# Altium project buck_converter.PrjPcb
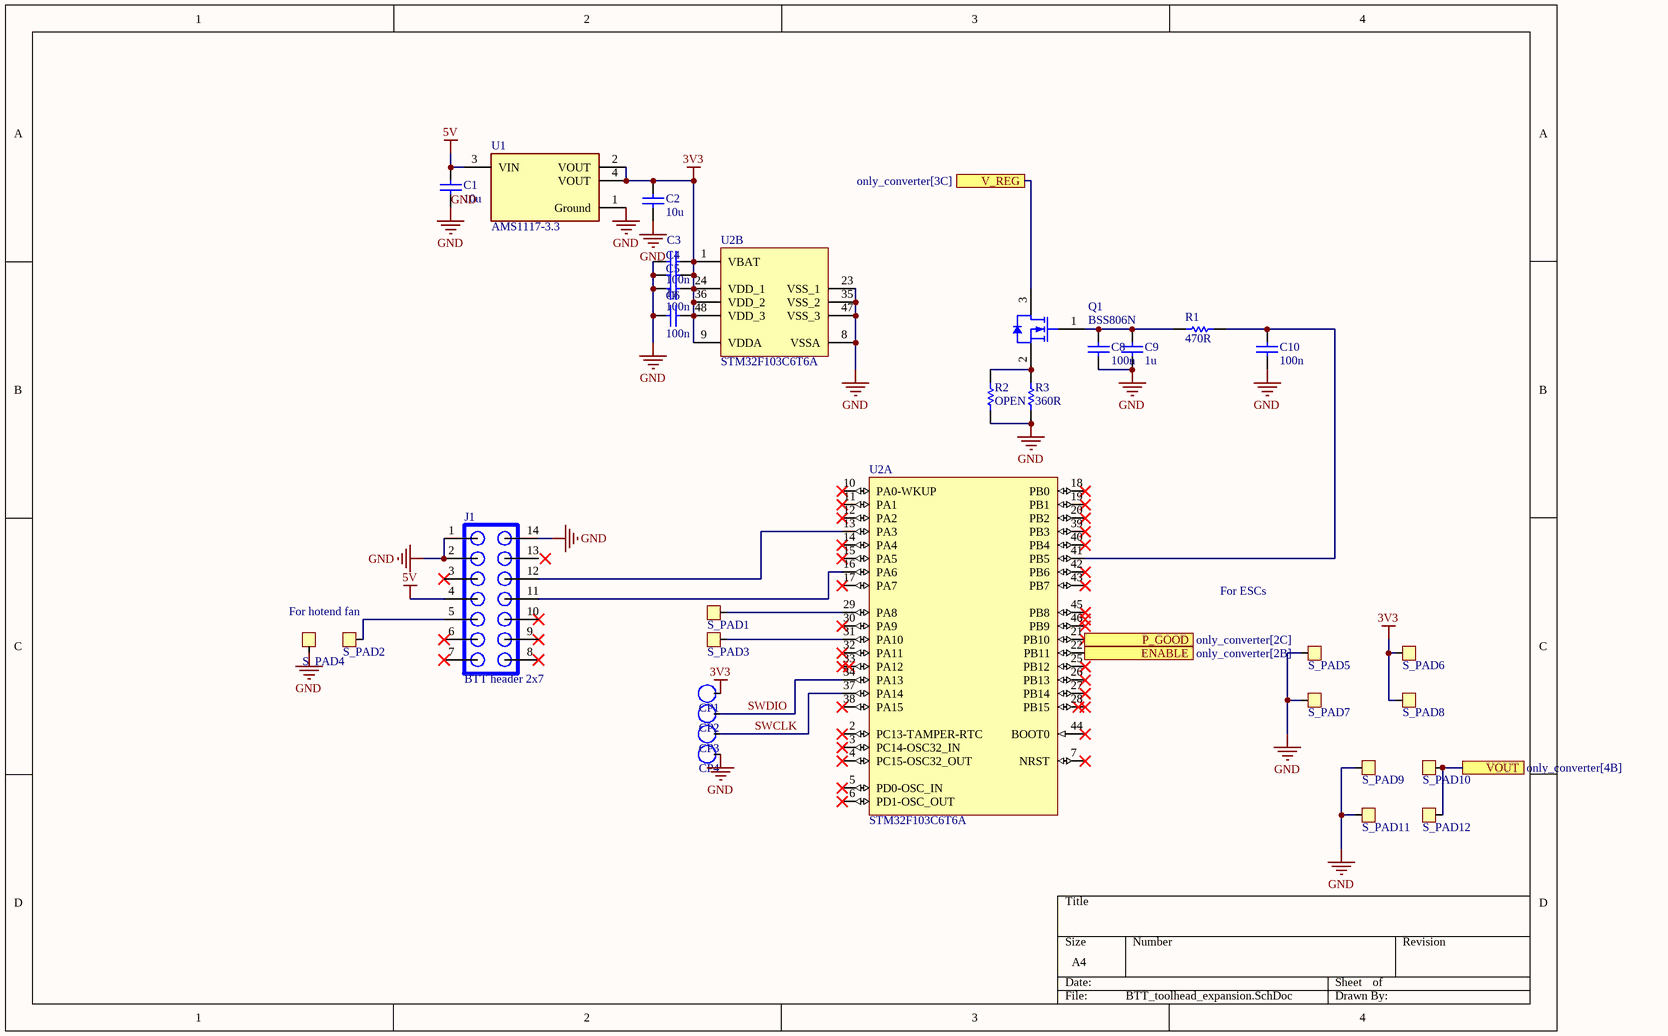
[diagram p0: BTT_toolhead_expansion.SchDoc]
2 sheets, 66 parts. Net scope: flat (ports and power ports of the same name join across sheets).
Board file: modular_pcb.PcbDoc
Sheets:
  BTT_toolhead_expansion.SchDoc
  only_converter.SchDoc

## Sheet BTT_toolhead_expansion.SchDoc
size A4; SheetNumber: 1; SheetTotal: 2

### Parts
C1  value 10u  [CAP FILM 0603_1608]  (hidden comment: Capacitor)
C2  value 10u  [CAP FILM 0603_1608]  (hidden comment: Capacitor)
C3  value 100n  [CAP FILM 0603_1608]  (hidden comment: Capacitor)
C4  value 1p  [CAP FILM 0603_1608]  (hidden comment: Capacitor)
C5  value 100n  [CAP FILM 0603_1608]  (hidden comment: Capacitor)
C6  value 100n  [CAP FILM 0603_1608]  (hidden comment: Capacitor)
C8  value 100n  [CAP FILM 0603_1608]  (hidden comment: Capacitor)
C9  value 1u  [CAP FILM 0603_1608]  (hidden comment: Capacitor)
C10  value 100n  [CAP FILM 0603_1608]  (hidden comment: Capacitor)
CP1  CONNECT_PAD  [ROUND_SMALL]  (value not drawn)
CP2  CONNECT_PAD  [ROUND_SMALL]  (value not drawn)
CP3  CONNECT_PAD  [ROUND_SMALL]  (value not drawn)
CP4  CONNECT_PAD  [ROUND_SMALL]  (value not drawn)
J1  BTT header 2x7  [BTT connector 2x7 THT]
Q1  BSS806N  [INF-PG-SOT23_M]
R1  value 470R  [RES 0603_1608]  (hidden comment: Resistor)
R2  value OPEN  [RES 0603_1608]  (hidden comment: Resistor)
R3  value 360R  [RES 0603_1608]  (hidden comment: Resistor)
S_PAD1  SOLDER_PAD  [PAD_SQUARE]  (value not drawn)
S_PAD2  SOLDER_PAD  [PAD_SQUARE]  (value not drawn)
S_PAD3  SOLDER_PAD  [PAD_SQUARE]  (value not drawn)
S_PAD4  SOLDER_PAD  [PAD_SQUARE]  (value not drawn)
S_PAD5  SOLDER_PAD  [PAD_SQUARE]  (value not drawn)
S_PAD6  SOLDER_PAD  [PAD_SQUARE]  (value not drawn)
S_PAD7  SOLDER_PAD  [PAD_SQUARE]  (value not drawn)
S_PAD8  SOLDER_PAD  [PAD_SQUARE]  (value not drawn)
S_PAD9  SOLDER_PAD  [PAD_SQUARE]  (value not drawn)
S_PAD10  SOLDER_PAD  [PAD_SQUARE]  (value not drawn)
S_PAD11  SOLDER_PAD  [PAD_SQUARE]  (value not drawn)
S_PAD12  SOLDER_PAD  [PAD_SQUARE]  (value not drawn)
U1  AMS1117-3.3  [FP-AMS1117-IPC_C]
U2  STM32F103C6T6A  [STM-LQFP48_M]  (parts A,B of 2)

### Ports
ENABLE (see only_converter[2B]), P_GOOD (see only_converter[2C]), V_REG (see only_converter[3C]), VOUT (see only_converter[4B])

### Nets
3V3: C2.2 C3.1 C4.1 C5.1 C6.1 CP1.1 S_PAD6.1 S_PAD8.1 U1.2(VOUT) U1.4(VOUT) U2.1(VBAT) U2.9(VDDA) U2.24(VDD_1) U2.36(VDD_2) U2.48(VDD_3)
5V: C1.2 J1.4 U1.3(VIN)
GND: C1.1 C2.1 C3.2 C4.2 C5.2 C6.2 C8.1 C9.1 C10.1 CP4.1 J1.1 J1.2 J1.14 R2.1 R3.1 S_PAD4.1 S_PAD5.1 S_PAD7.1 S_PAD9.1 S_PAD11.1 U1.1(Ground) U2.8(VSSA) U2.23(VSS_1) U2.35(VSS_2) U2.47(VSS_3)
VOUT: S_PAD10.1 S_PAD12.1 ; port VOUT
EN: U2.22(PB11) ; port ENABLE
FB: Q1.3(DRAIN) ; port V_REG
PG: U2.21(PB10) ; port P_GOOD
SWCLK: CP3.1 U2.37(PA14)
SWDIO: CP2.1 U2.34(PA13)
NetC8_2: C8.2 C9.2 Q1.1(GATE) R1.1
NetC10_2: C10.2 R1.2 U2.41(PB5)
NetJ1_5: J1.5 S_PAD2.1
NetJ1_11: J1.11 U2.16(PA6)
NetJ1_12: J1.12 U2.13(PA3)
NetQ1_2: Q1.2(SOURCE) R2.2 R3.2
NetS_PAD1_1: S_PAD1.1 U2.29(PA8)
NetS_PAD3_1: S_PAD3.1 U2.31(PA10)

Not connected (* = marked no-connect by the designer): J1 3* 6* 7* 8* 9* 10* 13; U2 2(PC13-TAMPER-RTC)* 3(PC14-OSC32_IN)* 4(PC15-OSC32_OUT)* 5(PD0-OSC_IN)* 6(PD1-OSC_OUT)* 7(NRST)* 10(PA0-WKUP)* 11(PA1)* 12(PA2)* 14(PA4)* 15(PA5)* 17(PA7)* 18(PB0)* 19(PB1)* 20(PB2)* 25(PB12)* 26(PB13)* 27(PB14)* 28(PB15)* 30(PA9)* 32(PA11)* 33(PA12)* 38(PA15)* 39(PB3)* 40(PB4)* 42(PB6)* 43(PB7)* 44(BOOT0)* 45(PB8)* 46(PB9)*

### Notes on the sheet
- For hotend fan
- For ESCs

### Library data of the parts
C1-C6 C8-C10 = Capacitor: SimulationGenericComponent: True
Q1 = CMP-1149-00036-1: N-Channel OptiMOS 2 Small-Signal-Transistor, 20 V VDS, 2.3 A ID, -55 to 150 degC, PG-SOT23, Reel, Green; Manufacturer: Infineon; VDS (max): 20 V; RthJA (max): 250 K/W; VGS(th) (max): 0.75Â V; QG: 1.7Â nC; RDS (on) (max) (@2.5V): 57 mOhm; VGS(th) (min): 0.3Â V; Ptot (max): 0.5Â W; Green: TRUE; IDpuls (max): 9.3Â A; ID (max): 2.3Â A; RDS (on) (max) (@1.8V): 82 mOhm; Halogen-free: TRUE; PackageVersion: Apr-08; PackageReference: PG-SOT23; PackageDescription: 3-Pin Small Outline Transistor Package, 2.9 x 1.3 mm Body, 0.95 mm Pitch; ComponentLink3URL: http://www.infineon.com/dgdl/SOT23-Package_Overview.pdf?folderId=db3a30431936bc4b0119532290053c66&fileId=db3a30431936bc4b0119533468123c85; ComponentLink3Description: Package Specification; ComponentLink2Description: Datasheet; Packing: Reel; Mounting Technology: Surface Mount; PartNumber: BSS806N; RDS (on) (max): 57 mOhm; ComponentLink2URL: http://www.infineon.com/dgdl/BSS806N_Rev2.3_.pdf?folderId=db3a3043156fd573011622e10b5c1f67&fileId=db3a304330f686060131185f0553451c; ComponentLink1URL: http://www.infineon.com/; ComponentLink1Description: Manufacturer URL; DatasheetVersion: Rev. 2.3
R1-R3 = Resistor: TC1: 0; SimulationGenericComponent: True; TC2: 0
U1 = CMP-209535-000001-1: LDO Voltage Regulators 1A, 3.3V; Manufacturer: Advanced Monolithic Systems; Dropout Voltage: 1.1V; Output Type: Fixed; Nominal Supply Current: 5mA; Max Power Dissipation: 1.2W; Max Supply Voltage: 15V; Number Of Outputs: 1; Standoff Height: 0.64mm; Max Junction Temp: +125°C; Height: 1.8mm; Package: AMS1117; Device Class L2: Power Management ICs; ComponentLink2Description: Datasheet; ComponentLink2URL: http://www.advanced-monolithic.com/pdf/ds1117.pdf; Category: IC; RoHS: TRUE; Automotive: No; Device Class L1: Integrated Circuits (ICs); Output Current: 1A; Device Class L3: Voltage Regulators - Linear; Temperature: -40°C to +125°C; Output Voltage: 3.3V; Manufacturer Part Number: AMS1117-3.3; Temperature Range Low: -40°C; Octopart: https://octopart.com/ams1117-3.3-advanced+monolithic+systems-25899300; Lead Free: Yes; Ipc Land Pattern Name: SOT229P700X180-4; Temperature Range High: +125°C
U2 = CMP-0237-00254-3: ARM Cortex-M3 32-bit MCU, 32 KB Flash, 10 KB Internal RAM, 37 I/Os, 48-pin LQFP, -40 to 85 degC, Tray; Operating Frequency(F) (Processor speed) (MHz): 72; A/D Converter: 2x12-bit (10 Channel); Supply Voltage(Vcc) min (V): 2; FLASH Size (Prog) (kB): 32; I/Os (High Current): 37; Internal RAM Size (kB): 10; PackageVersion: Rev. 6, 06/2013; ComponentLink3Description: Package Specification; ComponentLink2URL: http://www.st.com/st-web-ui/static/active/en/resource/technical/document/datasheet/CD00210843.pdf; ComponentLink1URL: http://www.st.com/web/en/home.html; PackageDescription: 48-Pin Low Profile Quad Flat Package, 7 x 7 mm Body, 0.5 mm Pitch; PartNumber: STM32F103C6T6A; ComponentLink3URL: http://www.st.com/st-web-ui/static/active/en/resource/technical/document/datasheet/DM00058181.pdf; PackageReference: LQFP48; Packing: Tray; ComponentLink2Description: Datasheet; Mounting Technology: Surface Mount; ComponentLink1Description: Manufacturer URL; Core: ARM Cortex-M3; DatasheetVersion: Rev. 6

## Sheet only_converter.SchDoc
size A4; SheetNumber: 2; SheetTotal: 2
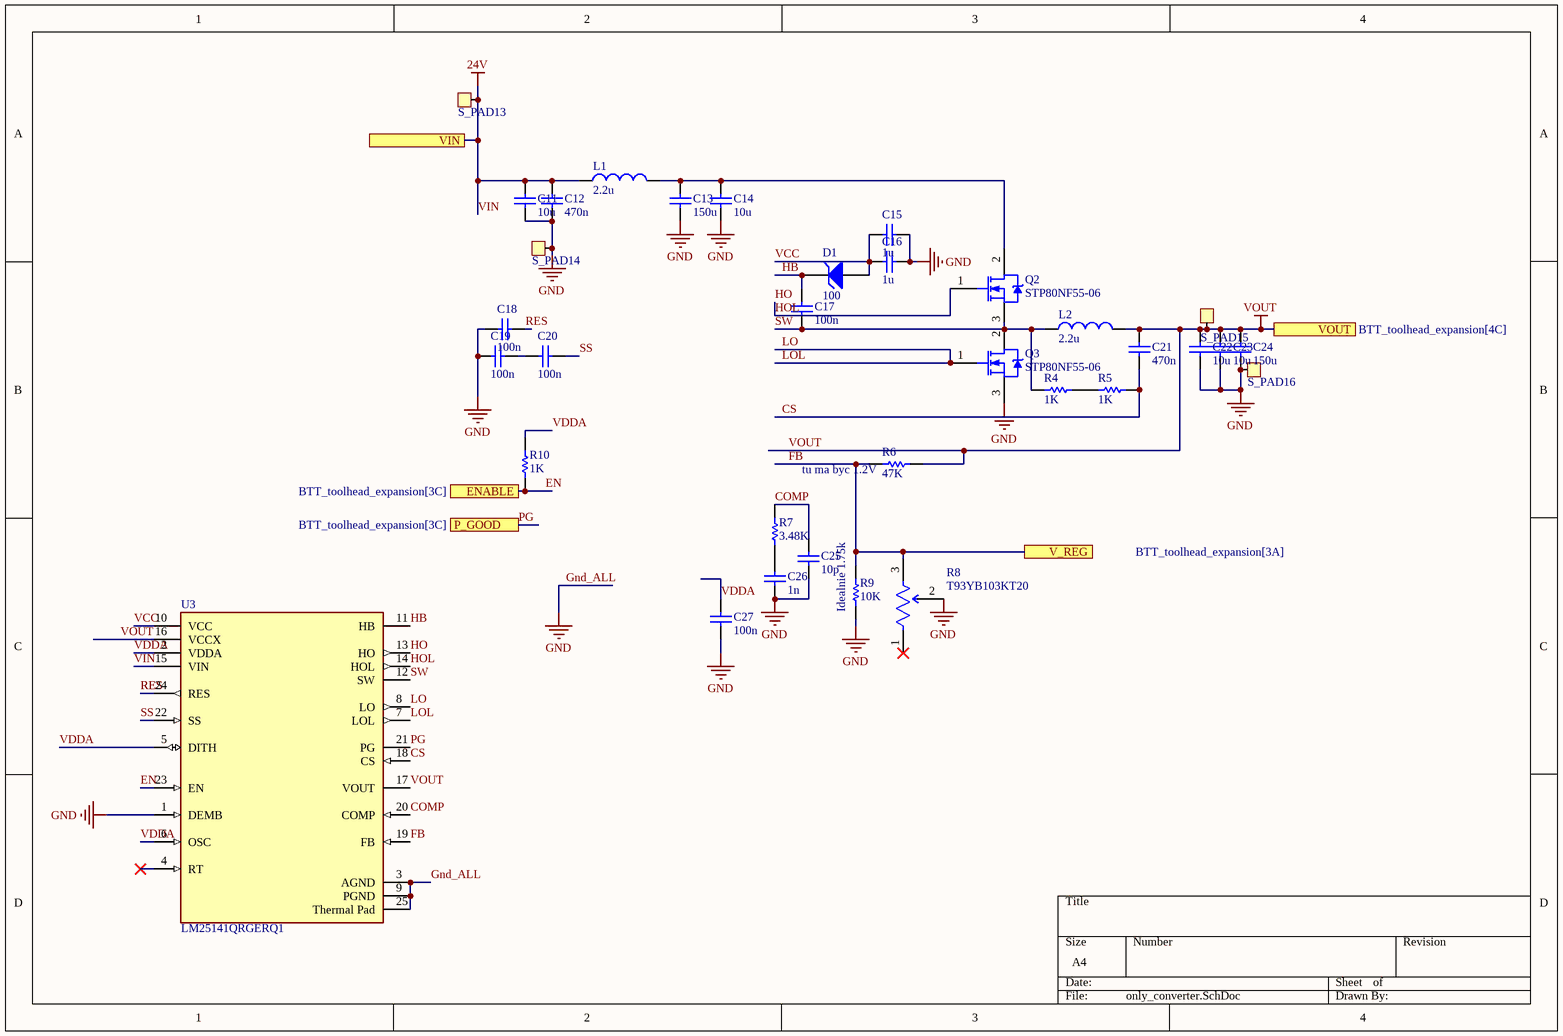
[diagram p1: only_converter.SchDoc]

### Parts
C11  value 10u  [CAP FILM 0805]  (hidden comment: Capacitor)
C12  value 470n  [CAP FILM 0603_1608]  (hidden comment: Capacitor)
C13  value 150u  [CAPAE7266X80M]  (hidden comment: Capacitor)
C14  value 10u  [CAP FILM 0805]  (hidden comment: Capacitor)
C15  value 1u  [CAP FILM 0603_1608]  (hidden comment: Capacitor)
C16  value 1u  [CAP FILM 0603_1608]  (hidden comment: Capacitor)
C17  value 100n  [CAP FILM 0603_1608]  (hidden comment: Capacitor)
C18  value 100n  [CAP FILM 0603_1608]  (hidden comment: Capacitor)
C19  value 100n  [CAP FILM 0603_1608]  (hidden comment: Capacitor)
C20  value 100n  [CAP FILM 0603_1608]  (hidden comment: Capacitor)
C21  value 470n  [CAP FILM 0603_1608]  (hidden comment: Capacitor)
C22  value 10u  [CAP FILM 0603_1608]  (hidden comment: Capacitor)
C23  value 10u  [CAP FILM 0603_1608]  (hidden comment: Capacitor)
C24  value 150u  [CAPAE7266X80M]  (hidden comment: Capacitor)
C25  value 10p  [CAP FILM 0603_1608]  (hidden comment: Capacitor)
C26  value 1n  [CAP FILM 0603_1608]  (hidden comment: Capacitor)
C27  value 100n  [CAP FILM 0603_1608]  (hidden comment: Capacitor)
D1  BV: 100  [SODFL375X135-2N]  (hidden comment: Zener Diode)
L1  value 2.2u  [INDP135128X65N]  (hidden comment: Inductor)
L2  value 2.2u  [INDP135128X65N]  (hidden comment: Inductor)
Q2  STP80NF55-06  [STM-TO-220A-3]
Q3  STP80NF55-06  [STM-TO-220A-3]
R4  value 1K  [RES 0603_1608]  (hidden comment: Resistor)
R5  value 1K  [RES 0603_1608]  (hidden comment: Resistor)
R6  value 47K  [RES 0603_1608]  (hidden comment: Resistor)
R7  value 3.48K  [RES 0603_1608]  (hidden comment: Resistor)
R8  T93YB103KT20  [FP-T93YB-MFG]
R9  value 10K  [RES 0603_1608]  (hidden comment: Resistor)
R10  value 1K  [RES 0603_1608 RF]  (hidden comment: Resistor)
S_PAD13  SOLDER_PAD  [POWER_PAD]  (value not drawn)
S_PAD14  SOLDER_PAD  [POWER_PAD]  (value not drawn)
S_PAD15  SOLDER_PAD  [POWER_PAD]  (value not drawn)
S_PAD16  SOLDER_PAD  [POWER_PAD]  (value not drawn)
U3  LM25141QRGERQ1  [FP-RGE0024J-IPC_A]

### Ports
ENABLE (see BTT_toolhead_expansion[3C]), P_GOOD (see BTT_toolhead_expansion[3C]), V_REG (see BTT_toolhead_expansion[3A]), VIN, VOUT (see BTT_toolhead_expansion[4C])

### Nets
GND: C11.1 C12.1 C13.1 C14.1 C15.1 C16.1 C18.1 C19.1 C22.1 C23.1 C24.1 C25.1 C26.1 C27.1 Q3.3(S) R8.2(b) R9.1 S_PAD14.1 S_PAD16.1 U3.1(DEMB) U3.3(AGND) U3.9(PGND) U3.25(Thermal_Pad)  [also labelled Gnd_ALL]
VIN: C11.2 C12.2 L1.1 S_PAD13.1 U3.15(VIN) ; port VIN  [also labelled 24V]
VOUT: C21.2 C22.2 C23.2 C24.2 L2.2 R6.2 S_PAD15.1 U3.16(VCCX) U3.17(VOUT) ; port VOUT
COMP: C25.2 R7.2 U3.20(COMP)
CS: C21.1 R5.2 U3.18(CS)
EN: R10.1 U3.23(EN) ; port ENABLE
FB: R6.1 R8.3(c) R9.2 U3.19(FB) ; port V_REG
HB: C17.2 D1.2(K) U3.11(HB)
HO: Q2.1(G) U3.13(HO) U3.14(HOL)  [also labelled HOL]
LO: Q3.1(G) U3.7(LOL) U3.8(LO)  [also labelled LOL]
PG: U3.21(PG) ; port P_GOOD
RES: C18.2 U3.24(RES)
SS: C20.2 U3.22(SS)
SW: C17.1 L2.1 Q2.3(S) Q3.2(D) R4.1 U3.12(SW)
VCC: C15.2 C16.2 D1.1(A) U3.10(VCC)
VDDA: C27.2 R10.2 U3.2(VDDA) U3.5(DITH) U3.6(OSC)
NetC13_2: C13.2 C14.2 L1.2 Q2.2(D)
NetC19_2: C19.2 C20.1
NetC26_2: C26.2 R7.1
NetR4_2: R4.2 R5.1

Not connected (* = marked no-connect by the designer): R8 1(a)*; U3 4(RT)*

### Notes on the sheet
- (near R6) tu ma byc 1.2V
- (near R9) Idealnie 1.75k

### Library data of the parts
C11 C14 C22 C23 = Capacitor: Daj tu ten wiekszy 0805 dzbanie; SimulationGenericComponent: True
C12 C15-C21 C25-C27 = Capacitor: SimulationGenericComponent: True
C13 C24 = Capacitor: to ten duzy elektrolityczny smd; SimulationGenericComponent: True
D1 = Zener Diode: AF: 1; BV_MAX: 1e99; CJO: 0; EG: 1.11; FC: 0.5; IBV: 0.001; IS: 1e-14; MJSW: 0.33; NTUN: 30; TNOM: 27; XTI: 3; SimulationGenericComponent: True; CJP: 0; CTA: 0; CTP: 0; FCS: 0.5; FV_MAX: 1e99; IKF: 0; IKR: 0; ISR: 1e-14; JSW: 0; JTUN: 0; JTUNSW: 0; KEG: 1; KF: 0; LEVEL: 1; N: 1; NBV: 1; NR: 1; NS: 1; PHP: 1; RS: 0; TCV: 0; TLEV: 0; TLEVC: 0; TM1: 0; TM2: 0; TPB: 0; TPHP: 0; TRS: 0; TRS2: 0; TT: 0; TTT1: 0; TTT2: 0; VJ: 1; XTITUN: 3
L1 L2 = Inductor: SimulationGenericComponent: True
Q2 Q3 = CMP-2000-07168-1: N-Channel STripFET(TM) II Power MOSFET, 55 V, 80 A, 5 mOhm, -55 to 175 degC, 3-Pin TO-220, RoHS, Tube; Manufacturer: STMicroelectronics; Minimum Gate Threshold Voltage: 2V; Maximum Gate Threshold Voltage: 4V; Channel Type: N; Maximum Drain Source Voltage: 55V; Transistor Configuration: Single; Maximum Drain Source Resistance: 0.007Ω; Number of Elements per Chip: 1; Maximum Continuous Drain Current: 80A; Typical Gate Charge @ Vgs: 142nC@10V; Channel Mode: Enhancement; Typical Turn-Off Delay Time: 125ns; Maximum Gate Source Voltage: ±20V; Transistor Material: Si; Maximum Power Dissipation: 300W; Typical Input Capacitance @ Vds: 4400pF@25V; Typical Turn-On Delay Time: 27ns; Length: 10.4mm; Datasheet Version: Rev. 8, 10/2006; Package Type: TO-220; Minimum Operating Temperature: -55°C; Pin Count: 3; Package Description: 3-Pin Transistor Outline Package, 10.2 x 4.5 mm, Pitch 2.55 mm; Mounting Type: ThroughHole; Datasheet URL: http://www.st.com/content/ccc/resource/technical/document/datasheet/f1/46/49/9e/39/8f/49/aa/CD00002670.pdf/files/CD00002670.pdf/jcr:content/translations/en.CD00002670.pdf; Manufacturer URL: http://www.st.com/; Package URL: http://www.st.com/st-web-ui/static/active/en/resource/technical/document/datasheet/CD00000544.pdf; Height: 9.15mm; Width: 4.6mm; Dimensions: 10.4x4.6x9.15mm; Maximum Operating Temperature: +175°C; Category: PowerMOSFET; Package Reference: TO-220; Mounting Technology: ThroughHole
R4-R7 R9 R10 = Resistor: TC1: 0; SimulationGenericComponent: True; TC2: 0
R8 = CMP-00030-39738570-1: T93YB103KT20 Resistor Trimmer, Cermet, 10 kOhm, ± 10%, 500 mW, 23 Turn, Multi Turn, Through Hole; Power Rating: 500mW; Number of Turns: 21; Voltage Rating (DC): 250V; Resistance: 10kΩ; Temperature Coefficient: 100ppm/°C; Radiation Hardening: No; NexarPartId: 39738570; Max Power Dissipation: 500mW; Military Standard: Not; Max Operating Temperature: 125°C; REACH SVHC: Unknown; Height: 9.8044mm; Voltage Rating: 250V; RoHS: Compliant; Min Operating Temperature: -55°C; Mount: PCB, Through Hole; Width: 5.0038mm; Taper: Linear; Termination: Pin; Composition: Cermet; Lead Free: Lead Free; Weight: 820.009956mg; Depth: 5mm; Schedule B: 8533400080, 8533400080; Tolerance: 10%; Length: 9.7028mm
U3 = CMP-04918-000466-1: AUTOMOTIVE, 2.2MHZ, LOW IQ SYNCH; Max Operating Temperature: 125°C; Min Operating Temperature: -40°C

## Nets that join several sheets
GND: BTT_toolhead_expansion (25 pins), only_converter (23 pins)
VOUT: BTT_toolhead_expansion (S_PAD10.1 S_PAD12.1), only_converter (9 pins)
EN: BTT_toolhead_expansion (U2.22), only_converter (R10.1 U3.23)
FB: BTT_toolhead_expansion (Q1.3), only_converter (R6.1 R8.3 R9.2 U3.19)
PG: BTT_toolhead_expansion (U2.21), only_converter (U3.21)